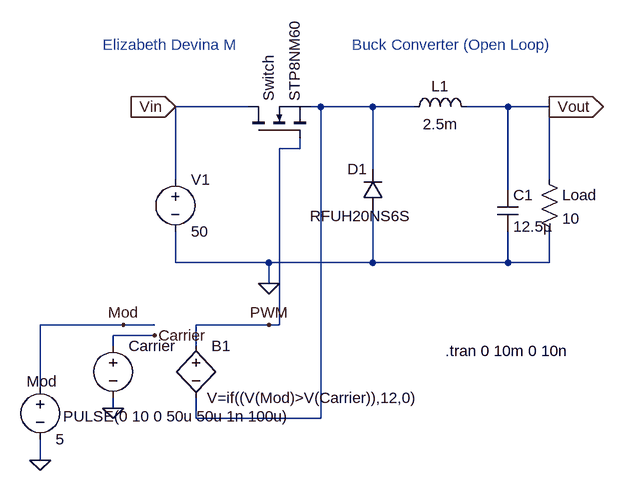
[diagram p0: schematic Elizabeth Devina M_477912_BuckConverter Openloop.asc]
Elizabeth Devina M_477912_BuckConverter Openloop.asc, the LTspice schematic file:
Version 4
SHEET 1 880 680
WIRE 80 0 -32 0
WIRE 192 0 176 0
WIRE 272 0 192 0
WIRE 336 0 272 0
WIRE 480 0 416 0
WIRE 544 0 480 0
WIRE 160 64 160 48
WIRE 160 64 128 64
WIRE 272 96 272 0
WIRE -32 112 -32 0
WIRE 544 112 544 0
WIRE 480 128 480 0
WIRE -32 240 -32 192
WIRE 112 240 -32 240
WIRE 272 240 272 160
WIRE 272 240 112 240
WIRE 480 240 480 192
WIRE 480 240 272 240
WIRE 544 240 544 192
WIRE 544 240 480 240
WIRE 112 272 112 240
WIRE -112 336 -240 336
WIRE -64 336 -112 336
WIRE 112 336 0 336
WIRE 128 336 128 64
WIRE 128 336 112 336
WIRE -64 352 -128 352
WIRE -128 368 -128 352
WIRE 0 368 0 336
WIRE -240 432 -240 336
WIRE -128 464 -128 448
WIRE 0 480 0 448
WIRE 192 480 192 0
WIRE 192 480 0 480
WIRE -240 544 -240 512
FLAG 112 272 0
FLAG -32 0 Vin
IOPIN -32 0 In
FLAG 544 0 Vout
IOPIN 544 0 Out
FLAG -128 464 0
FLAG -240 544 0
FLAG -64 352 Carrier
FLAG -112 336 Mod
FLAG 112 336 PWM
SYMBOL voltage -32 96 R0
WINDOW 123 0 0 Left 0
WINDOW 39 0 0 Left 0
SYMATTR InstName V1
SYMATTR Value 50
SYMBOL ind 320 16 R270
WINDOW 0 32 56 VTop 2
WINDOW 3 5 56 VBottom 2
SYMATTR InstName L1
SYMATTR Value 2.5m
SYMBOL cap 464 128 R0
SYMATTR InstName C1
SYMATTR Value 12.5µ
SYMBOL nmos 80 48 R270
SYMATTR InstName Switch
SYMATTR Value STP8NM60
SYMBOL res 528 96 R0
SYMATTR InstName Load
SYMATTR Value 10
SYMBOL diode 288 160 R180
WINDOW 0 24 64 Left 2
WINDOW 3 -43 -8 Left 2
SYMATTR InstName D1
SYMATTR Value RFUH20NS6S
SYMBOL voltage -240 416 R0
WINDOW 0 -21 7 Left 2
WINDOW 123 0 0 Left 0
WINDOW 39 0 0 Left 0
SYMATTR InstName Mod
SYMATTR Value 5
SYMBOL voltage -128 352 R0
WINDOW 3 -77 125 Left 2
WINDOW 123 0 0 Left 0
WINDOW 39 0 0 Left 0
SYMATTR Value PULSE(0 10 0 50u 50u 1n 100u)
SYMATTR InstName Carrier
SYMBOL bv 0 352 R0
WINDOW 3 17 96 Left 2
SYMATTR Value V=if((V(Mod)>V(Carrier)),12,0)
SYMATTR InstName B1
TEXT -144 -96 Left 2 ;Elizabeth Devina M
TEXT 240 -96 Left 2 ;Buck Converter (Open Loop)
TEXT 384 376 Left 2 !.tran 0 10m 0 10n

The netlist it stands for:
* Elizabeth Devina M_477912_BuckConverter Openloop.asc
V1 Vin 0 50
L1 N001 Vout 2.5m
C1 Vout 0 12.5µ
M§Switch Vin PWM N001 N001 STP8NM60
R§Load Vout 0 10
D1 0 N001 RFUH20NS6S
V§Mod Mod 0 5
V§Carrier Carrier 0 PULSE(0 10 0 50u 50u 1n 100u)
B1 PWM N001 V=if((V(Mod)>V(Carrier)),12,0)
.model D D
.lib standard.dio
.model NMOS NMOS
.model PMOS PMOS
.lib standard.mos
* Elizabeth Devina M
* Buck Converter (Open Loop)
.tran 0 10m 0 10n
.backanno
.end